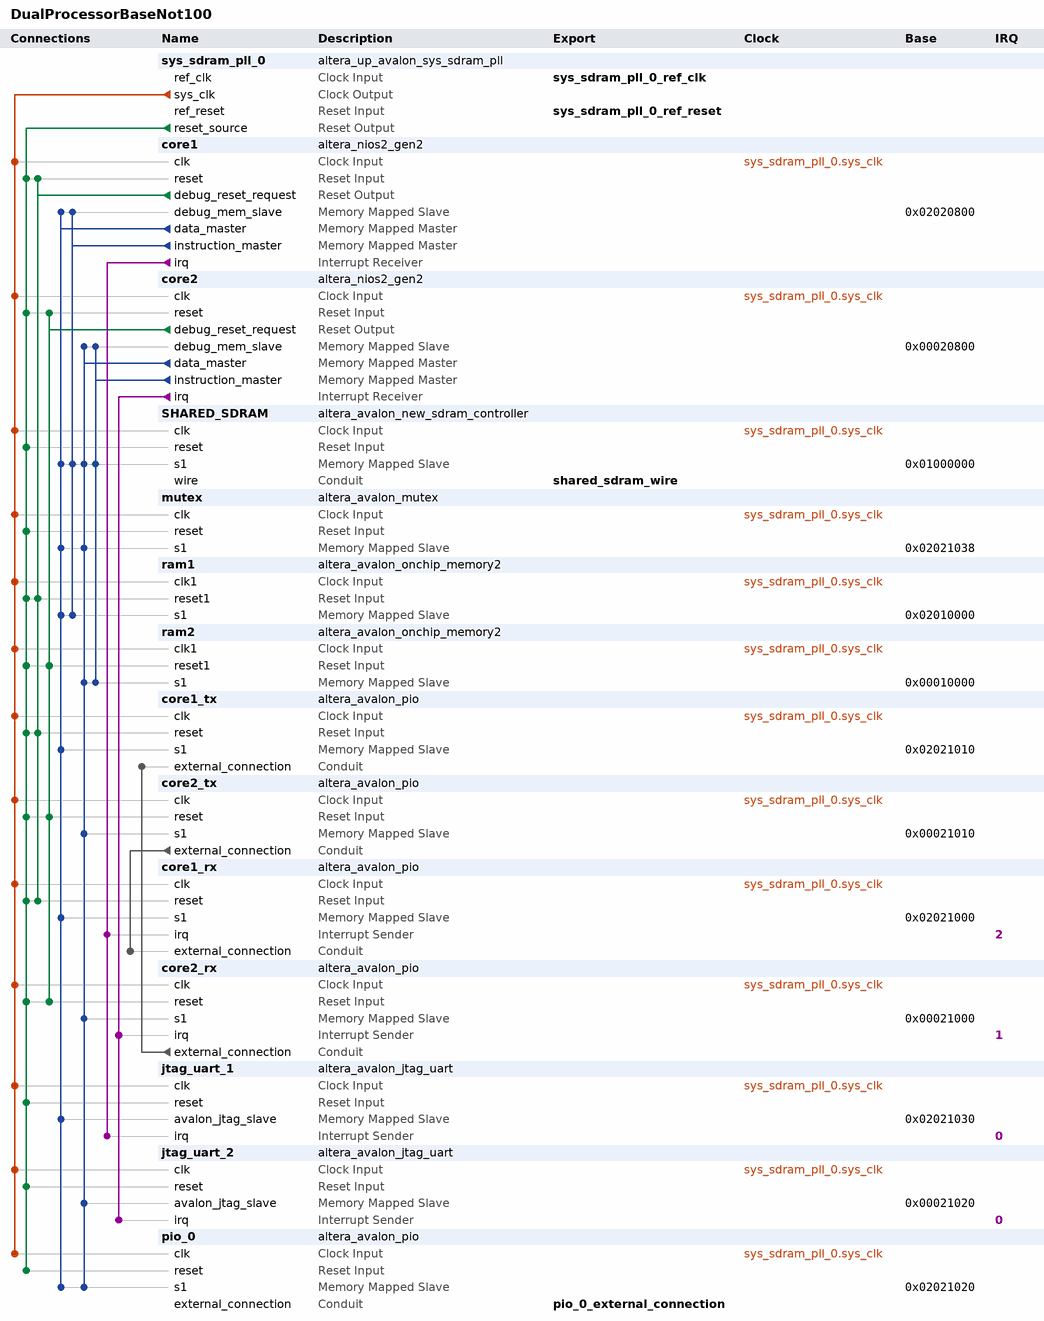
[diagram p0: system contents]
# Platform Designer (Qsys) system DualProcessorBaseNot100, MAX 10 10M50DAF484C7G
# Parameters at their usual value, and those the tool derives, are not listed.
package require -exact qsys 18.1
create_system DualProcessorBaseNot100
set_project_property DEVICE_FAMILY {MAX 10}
set_project_property DEVICE 10M50DAF484C7G

add_instance sys_sdram_pll_0 altera_up_avalon_sys_sdram_pll 18.0
set_instance_parameter_value sys_sdram_pll_0 CV_boards DE10-Standard
set_instance_parameter_value sys_sdram_pll_0 gui_outclk 50.0
set_instance_parameter_value sys_sdram_pll_0 gui_refclk 50.0

add_instance core1 altera_nios2_gen2 18.1
set_instance_parameter_value core1 dcache_size 2048
set_instance_parameter_value core1 exceptionSlave ram1.s1
set_instance_parameter_value core1 icache_size 4096
set_instance_parameter_value core1 impl Fast
set_instance_parameter_value core1 resetSlave ram1.s1

add_instance core2 altera_nios2_gen2 18.1
set_instance_parameter_value core2 cpuID 1
set_instance_parameter_value core2 dcache_size 2048
set_instance_parameter_value core2 exceptionSlave ram2.s1
set_instance_parameter_value core2 icache_size 4096
set_instance_parameter_value core2 impl Fast
set_instance_parameter_value core2 resetSlave ram2.s1

add_instance SHARED_SDRAM altera_avalon_new_sdram_controller 18.1
set_instance_parameter_value SHARED_SDRAM TAC 5.5
set_instance_parameter_value SHARED_SDRAM TRCD 20.0
set_instance_parameter_value SHARED_SDRAM TRP 20.0
set_instance_parameter_value SHARED_SDRAM casLatency 3
set_instance_parameter_value SHARED_SDRAM columnWidth 8
set_instance_parameter_value SHARED_SDRAM dataWidth 32
set_instance_parameter_value SHARED_SDRAM generateSimulationModel false
set_instance_parameter_value SHARED_SDRAM model single_Micron_MT48LC4M32B2_7_chip
set_instance_parameter_value SHARED_SDRAM numberOfBanks 4
set_instance_parameter_value SHARED_SDRAM numberOfChipSelects 1
set_instance_parameter_value SHARED_SDRAM powerUpDelay 100.0
set_instance_parameter_value SHARED_SDRAM refreshPeriod 15.625
set_instance_parameter_value SHARED_SDRAM rowWidth 12

add_instance mutex altera_avalon_mutex 18.1

add_instance ram1 altera_avalon_onchip_memory2 18.1
set_instance_parameter_value ram1 dataWidth 32
set_instance_parameter_value ram1 dualPort false
set_instance_parameter_value ram1 initMemContent true
set_instance_parameter_value ram1 initializationFileName onchip_mem.hex
set_instance_parameter_value ram1 memorySize 40960

add_instance ram2 altera_avalon_onchip_memory2 18.1
set_instance_parameter_value ram2 dataWidth 32
set_instance_parameter_value ram2 dualPort false
set_instance_parameter_value ram2 initMemContent true
set_instance_parameter_value ram2 initializationFileName onchip_mem.hex
set_instance_parameter_value ram2 memorySize 40960

add_instance core1_tx altera_avalon_pio 18.1
set_instance_parameter_value core1_tx direction Output
set_instance_parameter_value core1_tx width 1

add_instance core2_tx altera_avalon_pio 18.1
set_instance_parameter_value core2_tx direction Output
set_instance_parameter_value core2_tx width 1

add_instance core1_rx altera_avalon_pio 18.1
set_instance_parameter_value core1_rx direction Input
set_instance_parameter_value core1_rx generateIRQ true
set_instance_parameter_value core1_rx width 1

add_instance core2_rx altera_avalon_pio 18.1
set_instance_parameter_value core2_rx direction Input
set_instance_parameter_value core2_rx generateIRQ true
set_instance_parameter_value core2_rx width 1

add_instance jtag_uart_1 altera_avalon_jtag_uart 18.1
set_instance_parameter_value jtag_uart_1 simInteractiveOptions NO_INTERACTIVE_WINDOWS

add_instance jtag_uart_2 altera_avalon_jtag_uart 18.1
set_instance_parameter_value jtag_uart_2 simInteractiveOptions NO_INTERACTIVE_WINDOWS

add_instance pio_0 altera_avalon_pio 18.1
set_instance_parameter_value pio_0 direction Input
set_instance_parameter_value pio_0 width 32

# connections
add_connection sys_sdram_pll_0.sys_clk core1.clk clock
add_connection sys_sdram_pll_0.sys_clk core1_rx.clk clock
add_connection sys_sdram_pll_0.sys_clk core1_tx.clk clock
add_connection sys_sdram_pll_0.sys_clk core2.clk clock
add_connection sys_sdram_pll_0.sys_clk core2_rx.clk clock
add_connection sys_sdram_pll_0.sys_clk core2_tx.clk clock
add_connection sys_sdram_pll_0.sys_clk jtag_uart_1.clk clock
add_connection sys_sdram_pll_0.sys_clk jtag_uart_2.clk clock
add_connection sys_sdram_pll_0.sys_clk mutex.clk clock
add_connection sys_sdram_pll_0.sys_clk pio_0.clk clock
add_connection sys_sdram_pll_0.sys_clk ram1.clk1 clock
add_connection sys_sdram_pll_0.sys_clk ram2.clk1 clock
add_connection sys_sdram_pll_0.sys_clk SHARED_SDRAM.clk clock
add_connection core1.debug_reset_request core1.reset reset
add_connection core1.debug_reset_request core1_rx.reset reset
add_connection core1.debug_reset_request core1_tx.reset reset
add_connection core1.debug_reset_request ram1.reset1 reset
add_connection core2.debug_reset_request core2.reset reset
add_connection core2.debug_reset_request core2_rx.reset reset
add_connection core2.debug_reset_request core2_tx.reset reset
add_connection core2.debug_reset_request ram2.reset1 reset
add_connection sys_sdram_pll_0.reset_source core1.reset reset
add_connection sys_sdram_pll_0.reset_source core1_rx.reset reset
add_connection sys_sdram_pll_0.reset_source core1_tx.reset reset
add_connection sys_sdram_pll_0.reset_source core2.reset reset
add_connection sys_sdram_pll_0.reset_source core2_rx.reset reset
add_connection sys_sdram_pll_0.reset_source core2_tx.reset reset
add_connection sys_sdram_pll_0.reset_source jtag_uart_1.reset reset
add_connection sys_sdram_pll_0.reset_source jtag_uart_2.reset reset
add_connection sys_sdram_pll_0.reset_source mutex.reset reset
add_connection sys_sdram_pll_0.reset_source pio_0.reset reset
add_connection sys_sdram_pll_0.reset_source ram1.reset1 reset
add_connection sys_sdram_pll_0.reset_source ram2.reset1 reset
add_connection sys_sdram_pll_0.reset_source SHARED_SDRAM.reset reset
add_connection core1.data_master core1.debug_mem_slave avalon
set_connection_parameter_value core1.data_master/core1.debug_mem_slave baseAddress 0x02020800
add_connection core1.data_master core1_rx.s1 avalon
set_connection_parameter_value core1.data_master/core1_rx.s1 baseAddress 0x02021000
add_connection core1.data_master core1_tx.s1 avalon
set_connection_parameter_value core1.data_master/core1_tx.s1 baseAddress 0x02021010
add_connection core1.data_master jtag_uart_1.avalon_jtag_slave avalon
set_connection_parameter_value core1.data_master/jtag_uart_1.avalon_jtag_slave baseAddress 0x02021030
add_connection core1.data_master mutex.s1 avalon
set_connection_parameter_value core1.data_master/mutex.s1 baseAddress 0x02021038
add_connection core1.data_master pio_0.s1 avalon
set_connection_parameter_value core1.data_master/pio_0.s1 baseAddress 0x02021020
add_connection core1.data_master ram1.s1 avalon
set_connection_parameter_value core1.data_master/ram1.s1 baseAddress 0x02010000
add_connection core1.data_master SHARED_SDRAM.s1 avalon
set_connection_parameter_value core1.data_master/SHARED_SDRAM.s1 baseAddress 0x01000000
add_connection core1.instruction_master core1.debug_mem_slave avalon
set_connection_parameter_value core1.instruction_master/core1.debug_mem_slave baseAddress 0x02020800
add_connection core1.instruction_master ram1.s1 avalon
set_connection_parameter_value core1.instruction_master/ram1.s1 baseAddress 0x02010000
add_connection core1.instruction_master SHARED_SDRAM.s1 avalon
set_connection_parameter_value core1.instruction_master/SHARED_SDRAM.s1 baseAddress 0x01000000
add_connection core2.data_master core2.debug_mem_slave avalon
set_connection_parameter_value core2.data_master/core2.debug_mem_slave baseAddress 0x00020800
add_connection core2.data_master core2_rx.s1 avalon
set_connection_parameter_value core2.data_master/core2_rx.s1 baseAddress 0x00021000
add_connection core2.data_master core2_tx.s1 avalon
set_connection_parameter_value core2.data_master/core2_tx.s1 baseAddress 0x00021010
add_connection core2.data_master jtag_uart_2.avalon_jtag_slave avalon
set_connection_parameter_value core2.data_master/jtag_uart_2.avalon_jtag_slave baseAddress 0x00021020
add_connection core2.data_master mutex.s1 avalon
set_connection_parameter_value core2.data_master/mutex.s1 baseAddress 0x02021038
add_connection core2.data_master pio_0.s1 avalon
set_connection_parameter_value core2.data_master/pio_0.s1 baseAddress 0x02021020
add_connection core2.data_master ram2.s1 avalon
set_connection_parameter_value core2.data_master/ram2.s1 baseAddress 0x00010000
add_connection core2.data_master SHARED_SDRAM.s1 avalon
set_connection_parameter_value core2.data_master/SHARED_SDRAM.s1 baseAddress 0x01000000
add_connection core2.instruction_master core2.debug_mem_slave avalon
set_connection_parameter_value core2.instruction_master/core2.debug_mem_slave baseAddress 0x00020800
add_connection core2.instruction_master ram2.s1 avalon
set_connection_parameter_value core2.instruction_master/ram2.s1 baseAddress 0x00010000
add_connection core2.instruction_master SHARED_SDRAM.s1 avalon
set_connection_parameter_value core2.instruction_master/SHARED_SDRAM.s1 baseAddress 0x01000000
add_connection core2_rx.external_connection core1_tx.external_connection conduit
add_connection core2_tx.external_connection core1_rx.external_connection conduit
add_connection core1.irq core1_rx.irq interrupt
set_connection_parameter_value core1.irq/core1_rx.irq irqNumber 2
add_connection core1.irq jtag_uart_1.irq interrupt
set_connection_parameter_value core1.irq/jtag_uart_1.irq irqNumber 0
add_connection core2.irq core2_rx.irq interrupt
set_connection_parameter_value core2.irq/core2_rx.irq irqNumber 1
add_connection core2.irq jtag_uart_2.irq interrupt
set_connection_parameter_value core2.irq/jtag_uart_2.irq irqNumber 0

# exported interfaces
add_interface pio_0_external_connection conduit end
set_interface_property pio_0_external_connection EXPORT_OF pio_0.external_connection
add_interface shared_sdram_wire conduit end
set_interface_property shared_sdram_wire EXPORT_OF SHARED_SDRAM.wire
add_interface sys_sdram_pll_0_ref_clk clock sink
set_interface_property sys_sdram_pll_0_ref_clk EXPORT_OF sys_sdram_pll_0.ref_clk
add_interface sys_sdram_pll_0_ref_reset reset sink
set_interface_property sys_sdram_pll_0_ref_reset EXPORT_OF sys_sdram_pll_0.ref_reset

set_interconnect_requirement {$system} qsys_mm.clockCrossingAdapter HANDSHAKE
set_interconnect_requirement {$system} qsys_mm.enableEccProtection FALSE
set_interconnect_requirement {$system} qsys_mm.insertDefaultSlave FALSE
set_interconnect_requirement {$system} qsys_mm.maxAdditionalLatency 1

save_system DualProcessorBaseNot100.qsys
